# Altium schematic sheet [04]-Power.SchDoc
size A4
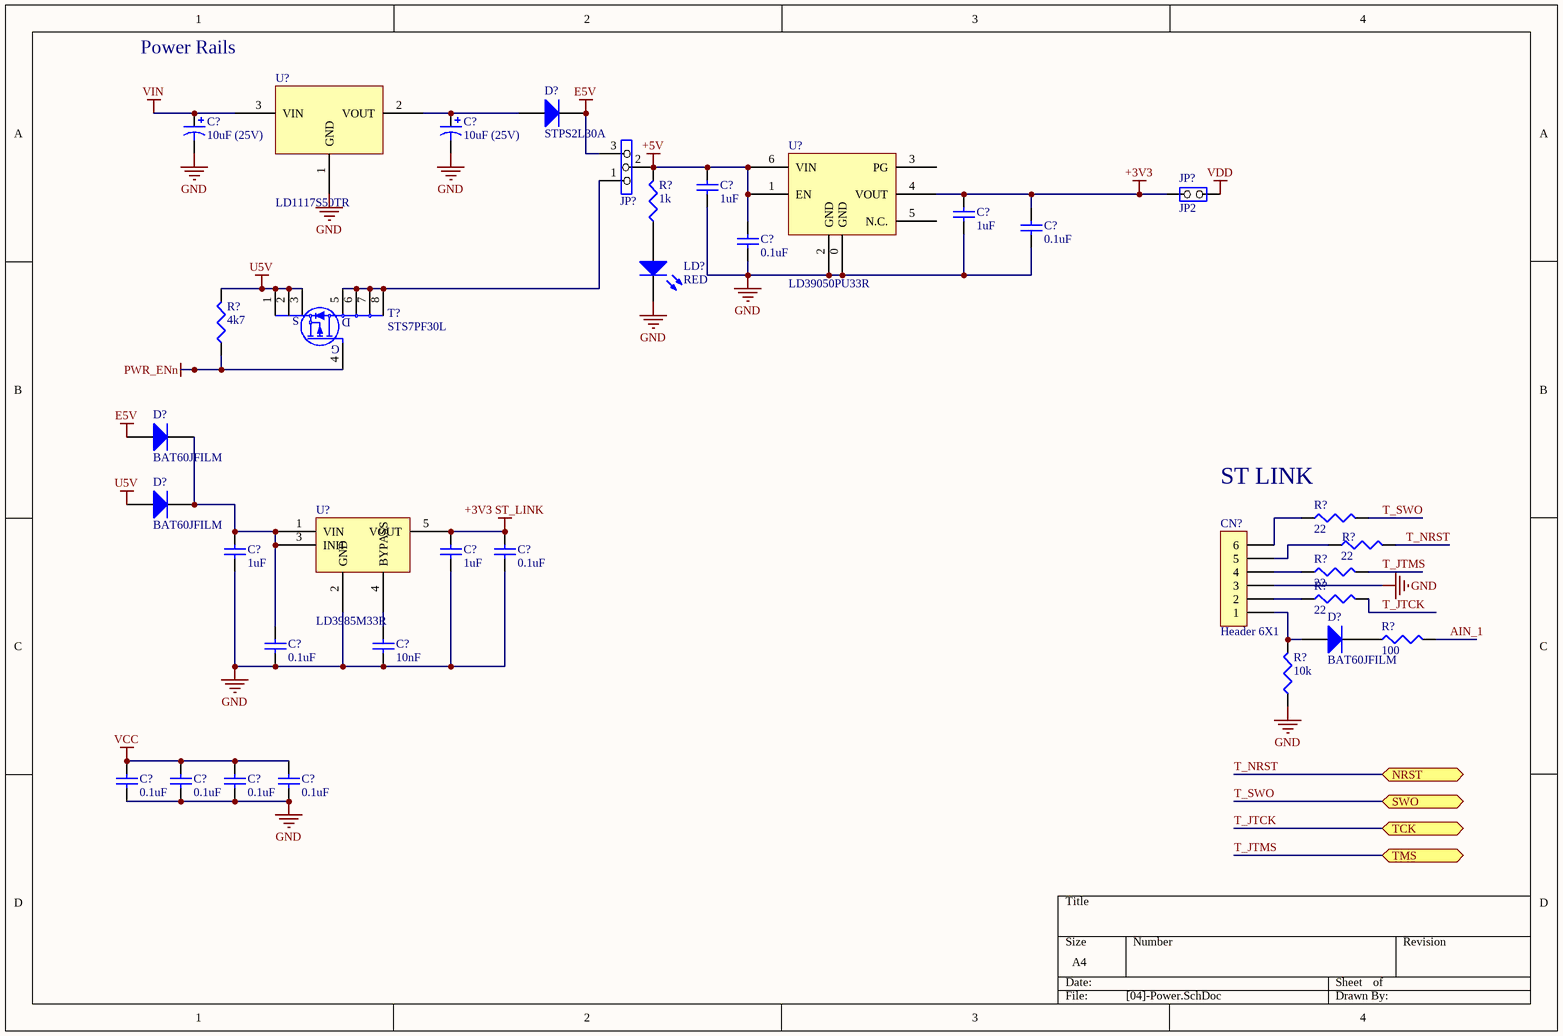
[diagram p0: [04]-Power.SchDoc]

## Parts
(Parts that share a designator on the sheet are numbered #1, #2 ... from top to bottom, then left to right.)
C?#1  10uF (25V)
C?#2  10uF (25V)
C?#3  1uF
C?#4  1uF
C?#5  0.1uF
C?#6  0.1uF
C?#7  0.1uF
C?#8  1uF
C?#9  1uF
C?#10  0.1uF
C?#11  10nF
C?#12  0.1uF
C?#13  0.1uF
C?#14  0.1uF
C?#15  0.1uF
CN?  Header 6X1  [1*6P]
D?#1  STPS2L30A
D?#2  BAT60JFILM
D?#3  BAT60JFILM
D?#4  BAT60JFILM
JP?#1  Jumper3  [SIP3]  (value not drawn)
JP?#2  JP2  [SIP2/2.54]
LD?  RED
R?#1  1k
R?#2  4k7
R?#3  22
R?#4  22
R?#5  22
R?#6  22
R?#7  100
R?#8  10k
T?  STS7PF30L  [SO8]
U?#1  LD1117S50TR
U?#2  LD39050PU33R
U?#3  LD3985M33R

## Ports
NRST, SWO, TCK, TMS

## Nets
+3V3: C?#4.2 C?#5.2 JP?#2.1(COMMON) U?#2.4(VOUT)
+3V3 ST_LINK: C?#7.2 C?#9.2 U?#3.5(VOUT)
+5V: C?#3.2 C?#6.2 JP?#1.2 R?#1.2 U?#2.1(EN) U?#2.6(VIN)
E5V: D?#1.2(K) D?#2.1(A) JP?#1.3
GND: C?#1.2 C?#2.2 C?#3.1 C?#4.1 C?#5.1 C?#6.1 C?#7.1 C?#8.1 C?#9.1 C?#10.1 C?#11.1 C?#12.1 C?#13.1 C?#14.1 C?#15.1 CN?.3 LD?.2(K) R?#8.1 U?#1.1(GND) U?#2.0(GND) U?#2.2(GND) U?#3.2(GND)
PWR_ENn: R?#2.1 T?.4(G)
U5V: D?#3.1(A) R?#2.2 T?.1(S) T?.2(S) T?.3(S)
VCC: C?#12.2 C?#13.2 C?#14.2 C?#15.2
VDD: JP?#2.2(NO)
VIN: C?#1.1 U?#1.3(VIN)
AIN_1: R?#7.2
T_JTCK: R?#6.2 ; port TCK
T_JTMS: R?#5.2 ; port TMS
T_NRST: R?#4.2 ; port NRST
T_SWO: R?#3.2 ; port SWO
NetC?#2_1: C?#2.1 D?#1.1(A) U?#1.2(VOUT)
NetC?#8_2: C?#8.2 C?#10.2 D?#2.2(K) D?#3.2(K) U?#3.1(VIN) U?#3.3(INH)
NetC?#11_2: C?#11.2 U?#3.4(BYPASS)
NetCN?_1: CN?.1 D?#4.1(A) R?#8.2
NetCN?_2: CN?.2 R?#6.1
NetCN?_4: CN?.4 R?#5.1
NetCN?_5: CN?.5 R?#4.1
NetCN?_6: CN?.6 R?#3.1
NetD?#4_2: D?#4.2(K) R?#7.1
NetJP?#1_1: JP?#1.1 T?.5(D) T?.6(D) T?.7(D) T?.8(D)
NetLD?_1: LD?.1(A) R?#1.1

Not connected (* = marked no-connect by the designer): U?#2 3(PG) 5(N.C.)

## Notes on the sheet
- Power Rails
- (near R?#3) ST LINK

## Library data of the parts
C?#1 C?#2 = EEE-1EA100SR: CAP ALUM 10UF 20% 25V SMD; Manufacturer: Panasonic Electronic Components; Lifetime @ Temp.: 2000 Hrs @ 85°C; Polarization: Polar; Surface Mount Land Size: 0.209" L x 0.209" W (5.30mm x 5.30mm); Checked: 0; Supplier 1: Digi-Key; Manufacturer Part Number: EEE-1EA100SR; RoHS: RoHS Compliant; Category: Capacitors; Stock 1: 11324; Pricing 1: 1=0.26, 10=0.182, 100=0.1093, 500=0.082 (EUR); Packaging: Cut Tape (CT); Part Status: Active; Tolerance: ±20%; ESR (Equivalent Series Resistance): -; Operating Temperature: -40°C ~ 85°C; Ratings: AEC-Q200; Applications: Automotive; Lead Spacing: -; Size / Dimension: 0.197" Dia (5.00mm); Height - Seated (Max): 0.213" (5.40mm); Mounting Type: Surface Mount; Package / Case: Radial, Can - SMD; ComponentLink1URL: https://industrial.panasonic.com/cdbs/www-data/pdf/RDE0000/ABA0000C1145.pdf; ComponentLink1Description: https://industrial.panasonic.com/cdbs/www-data/pdf/RDE0000/ABA0000C1145.pdf; Supplier Part Number 1: PCE3894CT-ND
C?#3 C?#4 C?#8 C?#9 = CL05A105KO5NNNC: CAP CER 1UF 16V X5R 0402; Manufacturer: Samsung Electro-Mechanics; Tolerance: ±10%; Notification: Current market demand for these product types have resulted in fluctuating and extending lead times. Lead times may differ.; Supplier 1: Digi-Key; Manufacturer Part Number: CL05A105KO5NNNC; RoHS: RoHS Compliant; Category: Capacitors; Stock 1: 0; Pricing 1: 1=0.07, 10=0.043, 100=0.0188, 500=0.01338, 1000=0.01052, 2500=0.00956, 5000=0.0088 (EUR); Packaging: Cut Tape (CT); Part Status: Active; Voltage - Rated: 16V; Temperature Coefficient: X5R; Operating Temperature: -55°C ~ 85°C; Features: -; Ratings: -; Applications: General Purpose; Mounting Type: Surface Mount, MLCC; Package / Case: 0402 (1005 Metric); Size / Dimension: 0.039" L x 0.020" W (1.00mm x 0.50mm); Height - Seated (Max): -; Thickness (Max): 0.022" (0.55mm); Lead Spacing: -; Lead Style: -; ComponentLink1URL: http://www.samsungsem.com/kr/support/product-search/mlcc/CL05A105KO5NNNC.jsp; ComponentLink1Description: http://www.samsungsem.com/kr/support/product-search/mlcc/CL05A105KO5NNNC.jsp; Supplier Part Number 1: 1276-1067-1-ND
C?#5-C?#7 C?#10 C?#12-C?#15 = CL05F104ZO5NNNC: CAP CER 0.1UF 16V Y5V 0402; Manufacturer: Samsung Electro-Mechanics; Tolerance: -20%, +80%; Temperature Coefficient: Y5V (F); Notification: Current market demand for these product types have resulted in fluctuating and extending lead times. Lead times may differ.; Checked: 0; Supplier 1: Digi-Key; Manufacturer Part Number: CL05F104ZO5NNNC; RoHS: RoHS Compliant; Category: Capacitors; Stock 1: 100000; Pricing 1: 1=0.09, 10=0.02, 100=0.009, 500=0.00642, 1000=0.00506, 2500=0.0046, 5000=0.00423 (EUR); Packaging: Cut Tape (CT); Part Status: Active; Voltage - Rated: 16V; Operating Temperature: -30°C ~ 85°C; Features: -; Ratings: -; Applications: General Purpose; Mounting Type: Surface Mount, MLCC; Package / Case: 0402 (1005 Metric); Size / Dimension: 0.039" L x 0.020" W (1.00mm x 0.50mm); Height - Seated (Max): -; Thickness (Max): 0.022" (0.55mm); Lead Spacing: -; Lead Style: -; ComponentLink1URL: http://www.samsungsem.com/kr/support/product-search/mlcc/CL05F104ZO5NNNC.jsp; ComponentLink1Description: http://www.samsungsem.com/kr/support/product-search/mlcc/CL05F104ZO5NNNC.jsp; Supplier Part Number 1: 1276-1004-1-ND
C?#11 = GRM033R71A103KA01D: CAP CER 10000PF 10V X7R 0201; Manufacturer: Murata Electronics North America; Tolerance: ±10%; Notification: Current market demand for these product types have resulted in fluctuating and extending lead times. Lead times may differ.; Checked: 0; Supplier 1: Digi-Key; Manufacturer Part Number: GRM033R71A103KA01D; RoHS: RoHS Compliant; Category: Capacitors; Stock 1: 150000; Pricing 1: 1=0.09, 10=0.028, 100=0.0126, 500=0.009, 1000=0.00707, 2500=0.00643, 5000=0.00591 (EUR); Packaging: Cut Tape (CT); Part Status: Active; Voltage - Rated: 10V; Temperature Coefficient: X7R; Operating Temperature: -55°C ~ 125°C; Features: -; Ratings: -; Applications: General Purpose; Mounting Type: Surface Mount, MLCC; Package / Case: 0201 (0603 Metric); Size / Dimension: 0.024" L x 0.012" W (0.60mm x 0.30mm); Height - Seated (Max): -; Thickness (Max): 0.013" (0.33mm); Lead Spacing: -; Lead Style: -; ComponentLink1URL: https://www.murata.com/~/media/webrenewal/support/library/catalog/products/capacitor/mlcc/c02e.ashx?la=en-us; ComponentLink1Description: https://www.murata.com/~/media/webrenewal/support/library/catalog/products/capacitor/mlcc/c02e.ashx?la=en-us; Supplier Part Number 1: 490-3194-1-ND
CN? = Header 6X1: Header, 6-Pin, Single row; LatestRevisionDate: 17-Jul-2002; LatestRevisionNote: Re-released for DXP Platform.; Publisher: Altium Limited
D?#1 = STPS2L30A: DIODE SCHOTTKY 30V 2A SMA; Manufacturer: STMicroelectronics; Speed: Fast Recovery =< 500ns, > 200mA (Io); Checked: 0; Supplier 1: Digi-Key; Manufacturer Part Number: STPS2L30A; RoHS: RoHS Compliant; Category: Discrete Semiconductor Products; Stock 1: 18699; Pricing 1: 1=0.4, 10=0.342, 100=0.2548, 500=0.20022, 1000=0.15472 (EUR); Packaging: Cut Tape (CT); Part Status: Active; Diode Type: Schottky; Current - Average Rectified (Io): 2A; Capacitance @ Vr, F: -; Mounting Type: Surface Mount; Package / Case: DO-214AC, SMA; Supplier Device Package: SMA; Operating Temperature - Junction: 150°C (Max); Base Part Number: STPS2L30; ComponentLink1URL: http://www.st.com/content/ccc/resource/technical/document/datasheet/62/6b/2e/7f/34/cb/43/55/CD00001633.pdf/files/CD00001633.pdf/jcr:content/translations/en.CD00001633.pdf; ComponentLink1Description: http://www.st.com/content/ccc/resource/technical/document/datasheet/62/6b/2e/7f/34/cb/43/55/CD00001633.pdf/files/CD00001633.pdf/jcr:content/translations/en.CD00001633.pdf; Supplier Part Number 1: 497-3759-1-ND
D?#2-D?#4 = BAT60JFILM: DIODE SCHOTTKY 10V 3A SOD323; Manufacturer: STMicroelectronics; Current - Average Rectified (Io): 3A (DC); Speed: Fast Recovery =< 500ns, > 200mA (Io); Checked: 0; Supplier 1: Digi-Key; Manufacturer Part Number: BAT60JFILM; RoHS: RoHS Compliant; Category: Discrete Semiconductor Products; Stock 1: 51918; Pricing 1: 1=0.34, 10=0.253, 100=0.1575, 500=0.10778, 1000=0.08292 (EUR); Packaging: Cut Tape (CT); Part Status: Active; Diode Type: Schottky; Capacitance @ Vr, F: -; Mounting Type: Surface Mount; Package / Case: SC-76, SOD-323; Supplier Device Package: SOD-323; Operating Temperature - Junction: 150°C (Max); Base Part Number: BAT60J; ComponentLink1URL: http://www.st.com/content/ccc/resource/technical/document/datasheet/3d/d2/27/1d/20/e3/4d/48/CD00001944.pdf/files/CD00001944.pdf/jcr:content/translations/en.CD00001944.pdf; ComponentLink1Description: http://www.st.com/content/ccc/resource/technical/document/datasheet/3d/d2/27/1d/20/e3/4d/48/CD00001944.pdf/files/CD00001944.pdf/jcr:content/translations/en.CD00001944.pdf; Supplier Part Number 1: 497-3707-1-ND
JP?#2 = JP2: Checked: 0
LD? = SML-D12U1WT86: LED RED DIFFUSED 1608 SMD; Manufacturer: Rohm Semiconductor; Lens Color: White; Millicandela Rating: 63mcd; Lens Style/Size: Rectangle with Flat Top, 1.20mm x 0.80mm; Voltage - Forward (Vf) (Typ): 2.2V; Current - Test: 20mA; Wavelength - Dominant: 620nm; Supplier 1: Digi-Key; Manufacturer Part Number: SML-D12U1WT86; RoHS: RoHS Compliant; Category: Optoelectronics; Stock 1: 139539; Pricing 1: 1=0.15, 10=0.116, 25=0.0852, 100=0.0608, 250=0.04128, 500=0.03644, 1000=0.02853 (EUR); Packaging: Cut Tape (CT); Part Status: Active; Color: Red; Lens Transparency: Diffused; Viewing Angle: -; Mounting Type: Surface Mount; Wavelength - Peak: -; Features: -; Package / Case: 0603 (1608 Metric); Supplier Device Package: 1608 (0603); Size / Dimension: 1.60mm L x 0.80mm W; Height (Max): 0.65mm; ComponentLink1URL: https://www.rohm.com/datasheet/SML-D12U1W; ComponentLink1Description: https://www.rohm.com/datasheet/SML-D12U1W; Supplier Part Number 1: SML-D12U1WT86CT-ND
R?#1 = RC0201FR-071KL: RES SMD 1K OHM 1% 1/20W 0201; Manufacturer: Yageo; Power (Watts): 0.05W, 1/20W; Temperature Coefficient: ±200ppm/°C; Checked: 0; Supplier 1: Digi-Key; Manufacturer Part Number: RC0201FR-071KL; RoHS: RoHS Compliant; Category: Resistors; Stock 1: 1634525; Pricing 1: 1=0.09, 10=0.039, 100=0.0159, 1000=0.00715, 2500=0.0062, 5000=0.00513 (EUR); Packaging: Cut Tape (CT); Part Status: Active; Tolerance: ±1%; Composition: Thick Film; Features: Moisture Resistant; Operating Temperature: -55°C ~ 125°C; Package / Case: 0201 (0603 Metric); Supplier Device Package: 0201; Size / Dimension: 0.024" L x 0.012" W (0.60mm x 0.30mm); Height - Seated (Max): 0.010" (0.26mm); Failure Rate: -; ComponentLink1URL: http://www.yageo.com/documents/recent/PYu-RC_Group_51_RoHS_L_9.pdf; ComponentLink1Description: http://www.yageo.com/documents/recent/PYu-RC_Group_51_RoHS_L_9.pdf; Supplier Part Number 1: 311-1KMCT-ND
R?#2 = RC1005F472CS: RES SMD 4.7K OHM 1% 1/16W 0402; Manufacturer: Samsung Electro-Mechanics; Power (Watts): 0.063W, 1/16W; Temperature Coefficient: ±100ppm/°C; Checked: 0; Supplier 1: Digi-Key; Manufacturer Part Number: RC1005F472CS; RoHS: RoHS Compliant; Category: Resistors; Stock 1: 1137263; Pricing 1: 1=0.09, 10=0.018, 100=0.0074, 1000=0.00332, 2500=0.00288, 5000=0.00238 (EUR); Packaging: Cut Tape (CT); Part Status: Active; Tolerance: ±1%; Composition: Thick Film; Features: Moisture Resistant; Operating Temperature: -55°C ~ 155°C; Package / Case: 0402 (1005 Metric); Supplier Device Package: 0402; Size / Dimension: 0.039" L x 0.020" W (1.00mm x 0.50mm); Height - Seated (Max): 0.016" (0.40mm); Failure Rate: -; ComponentLink1URL: http://www.samsungsem.com/kr/support/product-search/chip-resistor/RC1005F472CS.jsp; ComponentLink1Description: http://www.samsungsem.com/kr/support/product-search/chip-resistor/RC1005F472CS.jsp; Supplier Part Number 1: 1276-3466-1-ND
R?#3-R?#6 = RC1005F220CS: RES SMD 22 OHM 1% 1/16W 0402; Manufacturer: Samsung Electro-Mechanics; Power (Watts): 0.063W, 1/16W; Temperature Coefficient: ±100ppm/°C; Supplier 1: Digi-Key; Manufacturer Part Number: RC1005F220CS; RoHS: RoHS Compliant; Category: Resistors; Stock 1: 3036365; Pricing 1: 1=0.09, 10=0.018, 100=0.0074, 1000=0.00332, 2500=0.00288, 5000=0.00238 (EUR); Packaging: Cut Tape (CT); Part Status: Active; Tolerance: ±1%; Composition: Thick Film; Features: Moisture Resistant; Operating Temperature: -55°C ~ 155°C; Package / Case: 0402 (1005 Metric); Supplier Device Package: 0402; Size / Dimension: 0.039" L x 0.020" W (1.00mm x 0.50mm); Height - Seated (Max): 0.016" (0.40mm); Failure Rate: -; ComponentLink1URL: http://www.samsungsem.com/kr/support/product-search/chip-resistor/RC1005F220CS.jsp; ComponentLink1Description: http://www.samsungsem.com/kr/support/product-search/chip-resistor/RC1005F220CS.jsp; Supplier Part Number 1: 1276-3451-1-ND
R?#7 = RC0603F101CS: RES SMD 100 OHM 1% 1/20W 0201; Manufacturer: Samsung Electro-Mechanics; Power (Watts): 0.05W, 1/20W; Temperature Coefficient: ±250ppm/°C; Supplier 1: Digi-Key; Manufacturer Part Number: RC0603F101CS; RoHS: RoHS Compliant; Category: Resistors; Stock 1: 95449; Pricing 1: 1=0.09, 10=0.067, 100=0.0273, 1000=0.01227, 2500=0.01064, 5000=0.00879 (EUR); Packaging: Cut Tape (CT); Part Status: Active; Tolerance: ±1%; Composition: Thick Film; Features: Moisture Resistant; Operating Temperature: -55°C ~ 125°C; Package / Case: 0201 (0603 Metric); Supplier Device Package: 0201; Size / Dimension: 0.024" L x 0.012" W (0.60mm x 0.30mm); Height - Seated (Max): 0.010" (0.26mm); Failure Rate: -; ComponentLink1URL: http://www.samsungsem.com/kr/support/product-search/chip-resistor/RC0603F101CS.jsp; ComponentLink1Description: http://www.samsungsem.com/kr/support/product-search/chip-resistor/RC0603F101CS.jsp; Supplier Part Number 1: 1276-3601-1-ND
R?#8 = RR0510P-103-D: RES SMD 10K OHM 0.5% 1/16W 0402; Manufacturer: Susumu; Power (Watts): 0.063W, 1/16W; Temperature Coefficient: ±25ppm/°C; Checked: 0; Supplier 1: Digi-Key; Manufacturer Part Number: RR0510P-103-D; RoHS: RoHS Compliant; Category: Resistors; Stock 1: 48944; Pricing 1: 1=0.07, 10=0.062, 100=0.0238, 1000=0.01048, 2500=0.00905, 5000=0.0081 (EUR); Packaging: Cut Tape (CT); Part Status: Active; Tolerance: ±0.5%; Composition: Thin Film; Features: -; Operating Temperature: -55°C ~ 125°C; Package / Case: 0402 (1005 Metric); Supplier Device Package: -; Size / Dimension: 0.039" L x 0.020" W (1.00mm x 0.50mm); Height - Seated (Max): 0.016" (0.40mm); Failure Rate: -; ComponentLink1URL: http://www.susumu.co.jp/common/pdf/n_catalog_partition05_en.pdf; ComponentLink1Description: http://www.susumu.co.jp/common/pdf/n_catalog_partition05_en.pdf; Supplier Part Number 1: RR05P10.0KDCT-ND
U?#1 = LD1117S50TR: IC REG LINEAR 5V 800MA SOT223; Manufacturer: STMicroelectronics; Output Configuration: Positive; Output Type: Fixed; Voltage - Input (Max): 15V; Voltage Dropout (Max): 1.2V @ 800mA; PSRR: 75dB (120Hz); Protection Features: Over Current, Over Temperature; Checked: 0; Supplier 1: Digi-Key; Manufacturer Part Number: LD1117S50TR; RoHS: RoHS Compliant; Category: Integrated Circuits (ICs); Stock 1: 0; Pricing 1: 1=0.36, 10=0.307, 100=0.2292, 500=0.1801, 1000=0.13917 (EUR); Packaging: Cut Tape (CT); Part Status: Active; Voltage - Output (Min/Fixed): 5V; Voltage - Output (Max): -; Current - Output: 800mA; Control Features: -; Operating Temperature: 0°C ~ 125°C; Mounting Type: Surface Mount; Package / Case: TO-261-4, TO-261AA; Supplier Device Package: SOT-223; Base Part Number: LD1117; ComponentLink1URL: http://www.st.com/content/ccc/resource/technical/document/datasheet/99/3b/7d/91/91/51/4b/be/CD00000544.pdf/files/CD00000544.pdf/jcr:content/translations/en.CD00000544.pdf; ComponentLink1Description: http://www.st.com/content/ccc/resource/technical/document/datasheet/99/3b/7d/91/91/51/4b/be/CD00000544.pdf/files/CD00000544.pdf/jcr:content/translations/en.CD00000544.pdf; Supplier Part Number 1: 497-6447-1-ND
U?#2 = LD39050PU33R: IC REG LINEAR 3.3V 500MA 6DFN; Manufacturer: STMicroelectronics; Output Configuration: Positive; Output Type: Fixed; Voltage - Input (Max): 5.5V; Voltage Dropout (Max): 0.4V @ 500mA; PSRR: 65dB ~ 62dB (1kHz ~ 10kHz); Control Features: Enable, Power Good; Protection Features: Over Current, Over Temperature, Short Circuit; Checked: 0; Supplier 1: Digi-Key; Manufacturer Part Number: LD39050PU33R; RoHS: RoHS Compliant; Category: Integrated Circuits (ICs); Stock 1: 7317; Pricing 1: 1=0.95, 10=0.853, 100=0.6645, 500=0.54894, 1000=0.43337 (EUR); Packaging: Cut Tape (CT); Part Status: Active; Voltage - Output (Min/Fixed): 3.3V; Voltage - Output (Max): -; Current - Output: 500mA; Operating Temperature: -40°C ~ 125°C; Mounting Type: Surface Mount; Package / Case: 6-VDFN Exposed Pad; Supplier Device Package: 6-DFN (3x3); Base Part Number: LD39050; ComponentLink1URL: http://www.st.com/content/ccc/resource/technical/document/datasheet/12/43/cc/93/21/f6/41/66/CD00227527.pdf/files/CD00227527.pdf/jcr:content/translations/en.CD00227527.pdf; ComponentLink1Description: http://www.st.com/content/ccc/resource/technical/document/datasheet/12/43/cc/93/21/f6/41/66/CD00227527.pdf/files/CD00227527.pdf/jcr:content/translations/en.CD00227527.pdf; Supplier Part Number 1: 497-8716-1-ND
U?#3 = LD3985M33R: IC REG LINEAR 3.3V 150MA SOT23-5; Manufacturer: STMicroelectronics; Output Configuration: Positive; Output Type: Fixed; Voltage - Input (Max): 6V; Voltage Dropout (Max): 0.1V @ 150mA; PSRR: 60dB ~ 50dB (1kHz ~ 10kHz); Control Features: Enable; Protection Features: Over Current, Over Temperature; Checked: 0; Supplier 1: Digi-Key; Manufacturer Part Number: LD3985M33R; RoHS: RoHS Compliant; Category: Integrated Circuits (ICs); Stock 1: 4402; Pricing 1: 1=0.53, 10=0.462, 100=0.3544, 500=0.28016, 1000=0.22413 (EUR); Packaging: Cut Tape (CT); Part Status: Active; Voltage - Output (Min/Fixed): 3.3V; Voltage - Output (Max): -; Current - Output: 150mA; Operating Temperature: -40°C ~ 125°C; Mounting Type: Surface Mount; Package / Case: SC-74A, SOT-753; Supplier Device Package: SOT-23-5; Base Part Number: LD3985; ComponentLink1URL: http://www.st.com/content/ccc/resource/technical/document/datasheet/group2/96/39/79/10/c9/1a/48/92/CD00003395/files/CD00003395.pdf/jcr:content/translations/en.CD00003395.pdf; ComponentLink1Description: http://www.st.com/content/ccc/resource/technical/document/datasheet/group2/96/39/79/10/c9/1a/48/92/CD00003395/files/CD00003395.pdf/jcr:content/translations/en.CD00003395.pdf; Supplier Part Number 1: 497-3504-1-ND
T? = STS7PF30L: Supplier 1: Allied Electronics; Supplier Part Number 1: 70341374